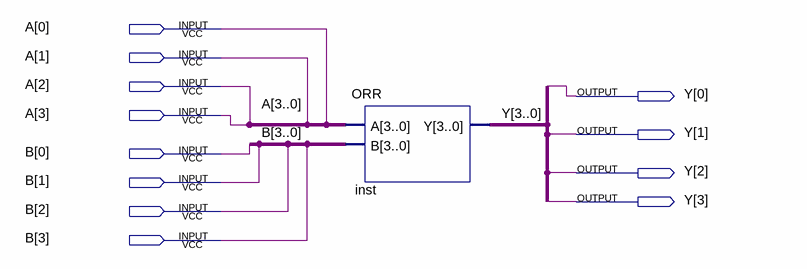
[diagram p0: schematic sheet]
// Quartus schematic ORRblock.bdf as structural Verilog: 1 symbols, 12 pins
module ORRblock (
  input  [3:0] A,
  input  [3:0] B,
  output [3:0] Y
);

  ORR inst (.A(A), .B(B), .Y(Y));
endmodule
